# EAGLE design DCtoDC_s (EAGLE 6.4)
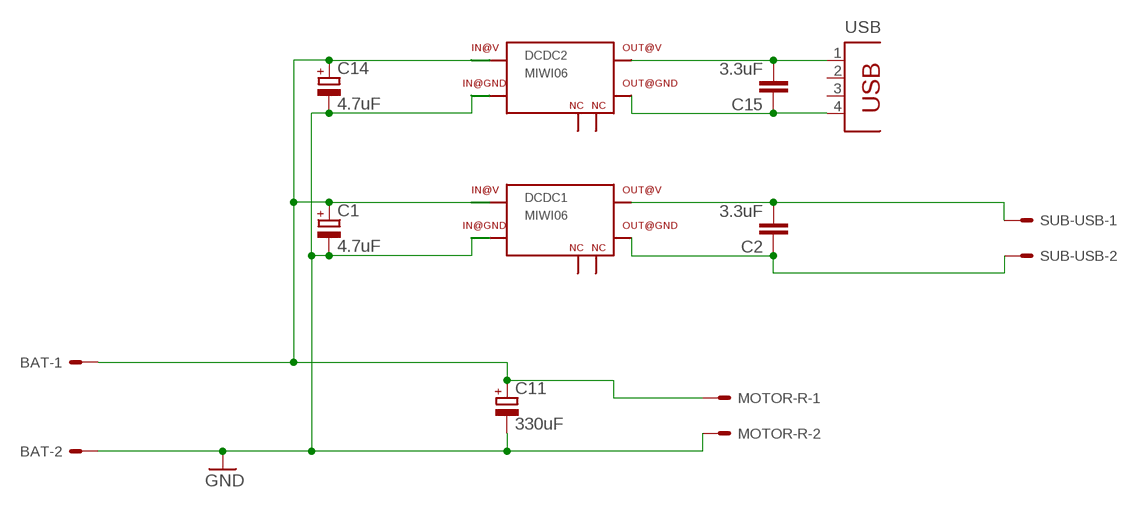
[diagram p0: schematic, sheet 1]

## Parts
BAT  KK-156-2  [KK-156-2]
C1  4.7uF  CPOL-EUD/7343-31W  [D/7343-31W]
C2  3.3uF  C-EUC3216  [C3216]
C11  330uF  CPOL-EUD/7343-31W  [D/7343-31W]
C14  4.7uF  CPOL-EUD/7343-31W  [D/7343-31W]
C15  3.3uF  C-EUC3216  [C3216]
DCDC1  MIWI06  [MIWI06]
DCDC2  MIWI06  [MIWI06]
MOTOR-R  KK-156-2  [KK-156-2]
SUB-USB  KK-156-2  [KK-156-2]
USB  PN87520  [PN87520]

## Nets
5V: C15.2 DCDC2.V@OUT USB.1
GND: BAT.2 C1.- C11.- C14.- DCDC1.GND@IN1 DCDC2.GND@IN1 MOTOR-R.2
N$7: C2.2 DCDC1.V@OUT SUB-USB.1
N$8: C2.1 DCDC1.GND@OUT SUB-USB.2
N$11: C15.1 DCDC2.GND@OUT USB.4
N$15: BAT.1 C1.+ C11.+ C14.+ DCDC1.V@IN1 DCDC2.V@IN1 MOTOR-R.1
Unconnected: DCDC1.NC DCDC1.NOPIN DCDC2.NC DCDC2.NOPIN USB.2 USB.3

## Power pins joined to a net without a drawn wire
23: DCDC1.V@IN2 DCDC2.V@IN2
GND: DCDC1.GND@IN2 DCDC2.GND@IN2

## Library data of the parts
BAT MOTOR-R SUB-USB = con-molex:KK-156-2: KK 156 HEADER Source: http://www.molex.com/pdm_docs/sd/026604100_sd.pdf; OC_FARNELL: unknown; OC_NEWARK: unknown
C1 C11 C14 = resistor:CPOL-EU: POLARIZED CAPACITOR, European symbol
C2 C15 = resistor:C-EU: CAPACITOR, European symbol
DCDC1 DCDC2 = miwi06:MIWI06
USB = con-berg:PN87520: BERG USB connector; OC_FARNELL: unknown; OC_NEWARK: unknown

## Board
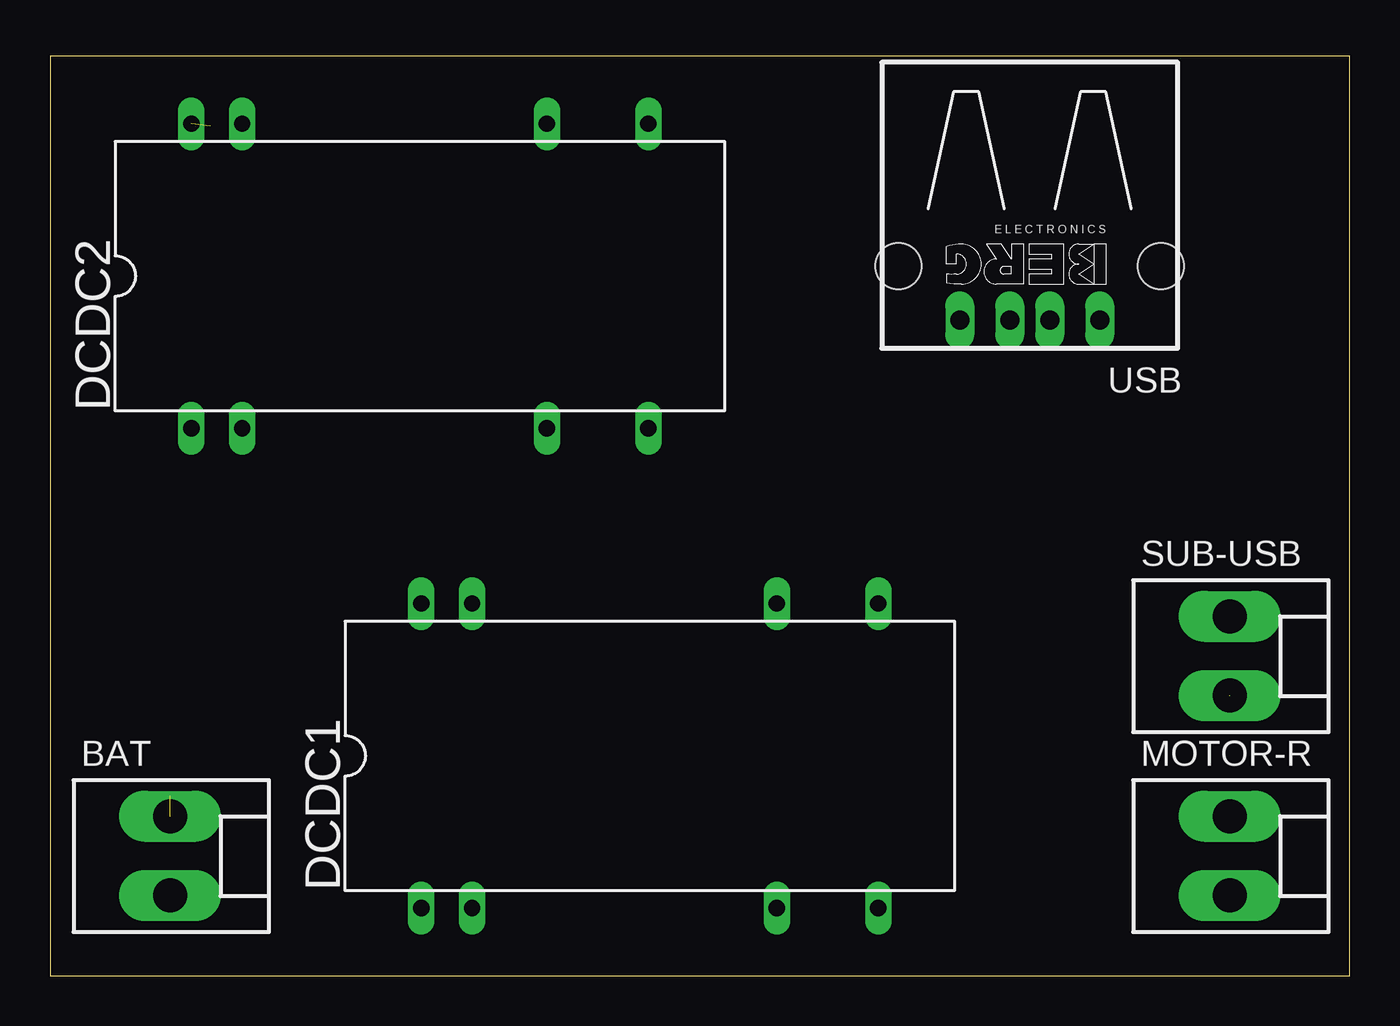
[diagram p1: board, top side]
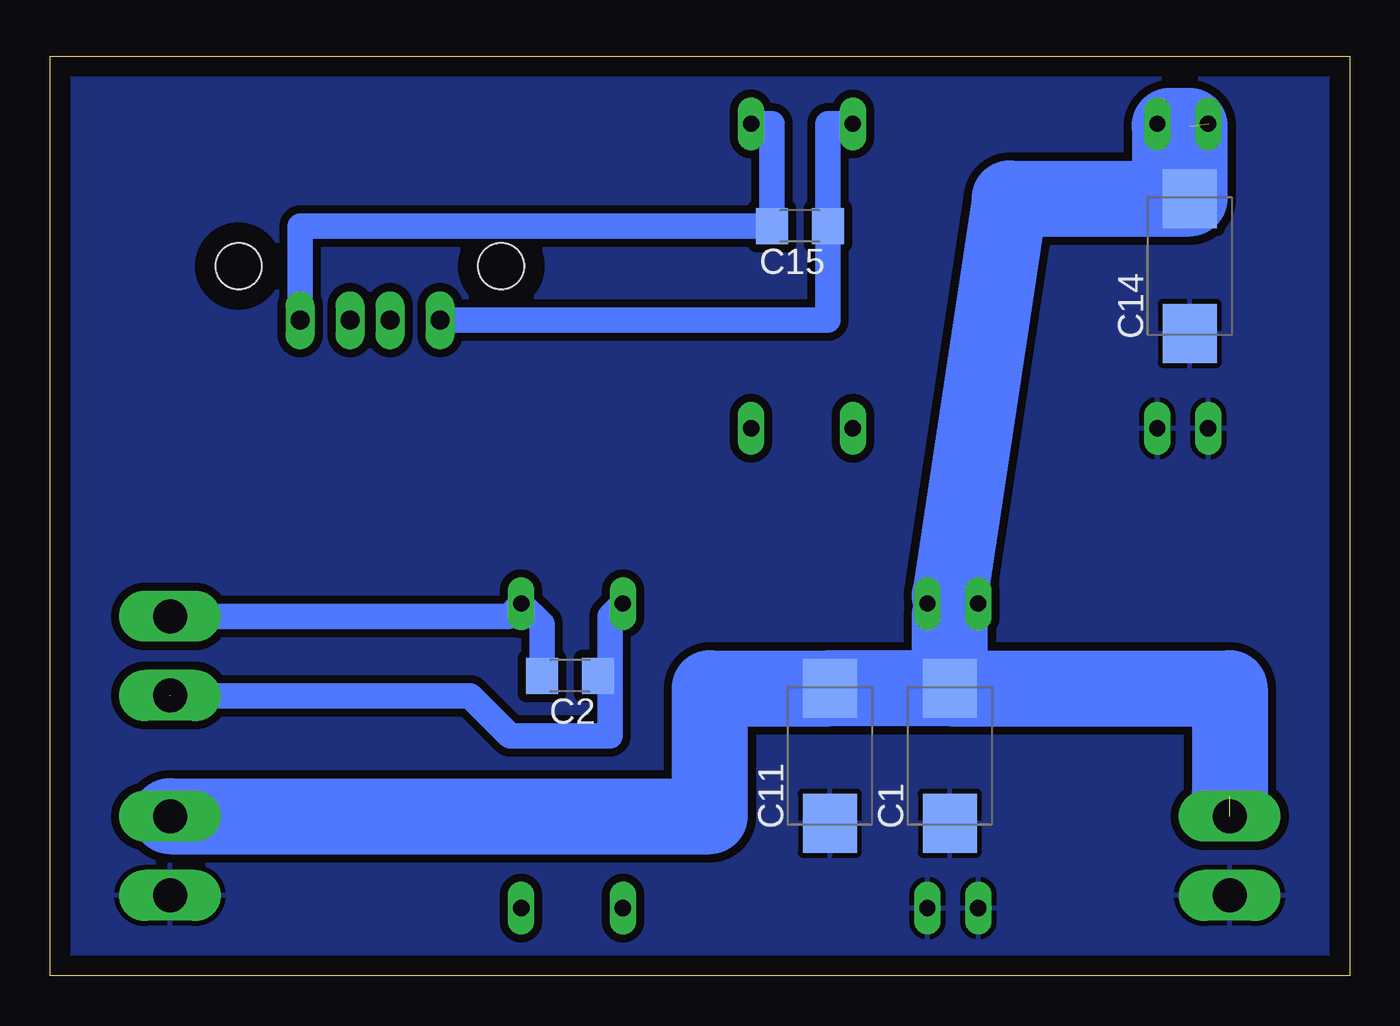
[diagram p2: board, bottom side, seen from below]

Size 65 x 46 mm. Coordinates in mm from the lower left corner, seen from the top.
Outline: 0,0 65,0 65,46 0,46 0,0
Copper layers (1*16): Top 0.035mm / dielectric 1.5mm / Bottom 0.035mm
Design rules "default": minimum track width 10mil, minimum drill 24mil, track to track 8mil, track to pad 8mil, pad to pad 8mil, via to via 8mil, smd to smd 8mil, copper to edge 40mil, drill to drill 8mil, minimum pad ring 10mil, minimum via ring 8mil, stop-mask expansion 4mil, vias tented up to drill 0mil, thermal gap 10mil

### Footprints (pad centres in the part's own frame; a part is rotated, then mirrored left to right if it is on the bottom)
KK-156-2 = drill 1.7 pad 2.184 long: 1 -1.98,0; 2 1.98,0
D/7343-31W = smd 2.95 x 2.7: + 3.375,0; - -3.375,0
C3216 = smd 1.6 x 1.8: 1 -1.4,0; 2 1.4,0
MIWI06 = drill 0.813 long: GND@IN1 -11.43,-7.62; GND@IN2 -8.89,-7.62; GND@OUT 6.35,7.62; NC 11.43,-7.62; NOPIN 6.35,-7.62; V@IN1 -11.43,7.62; V@IN2 -8.89,7.62; V@OUT 11.43,7.62
PN87520 = drill 0.95 long: 1 -3.5,2.71; 2 -1,2.71; 3 1,2.71; 4 3.5,2.71 | hole 2.3: -6.57,0; 6.57,0

### Placement (x,y rotation side)
BAT  6,6 270 top
C1  20,11 90 bottom
C2  39,15 180 bottom
C11  26,11 90 bottom
C14  8,35.5 90 bottom
C15  27.5,37.5 180 bottom
DCDC1  30,11 0 top
DCDC2  18.5,35 0 top
MOTOR-R  59,6 270 top
SUB-USB  59,16 270 top
USB  49,35.5 180 top

### Tracks (layer width: path | path; a pad name or v marks a point on that pad's centre or on a via)
5V
  Bottom 1.27: USB.1 52.5,37.5 C15.2 28.9,42.62 DCDC2.V@OUT
23
  Bottom 0.406: DCDC2.V@IN2 9,42.62 9,39 17,39 17,38 18,38 21,18 21.11,18 DCDC1.V@IN2
GND
  pour Bottom (isolate 0.406): 0,46 65,46 65,0 0,0
N$1  (via drill 0.5)
  other vias: 42.4,35.5
N$2  (via drill 0.5)
  other vias: 55.6,35.5
N$7
  Bottom 1.27: SUB-USB.1 42.07,17.98 DCDC1.V@OUT 40.4,17.59 C2.2
N$8  (1 unrouted)
  Bottom 1.27: DCDC1.GND@OUT 37,17.97 37,15.6 | 37,15.6 37,15 | 37,15 C2.1 37,15.6 | 37,15 37,12 42,12 44,14 59,14
N$11
  Bottom 1.27: USB.4 26.1,32.79 C15.1 26.1,42.62 DCDC2.GND@OUT
N$15  (2 unrouted)
  Bottom 0.254: DCDC1.V@IN1 18.95,19 19,19 | 20,19 19,19 | 19,19 20,18
  Bottom 3.81: 20,19 17,38.88 C14.+ 8,42.5 9,42.5 9,39 | C1.+ C11.+ 32,14.38 32,7.98 MOTOR-R.1 | C1.+ 20,18 | C1.+ 6,14.38 6,9